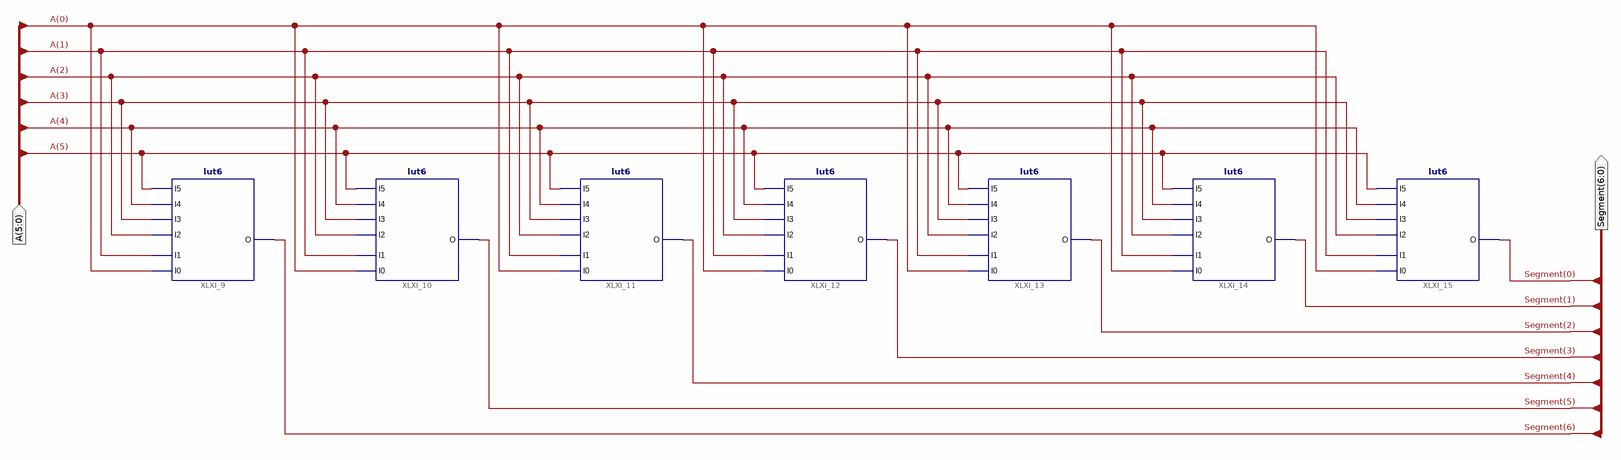
[diagram p0: schematic sheet 1]
// Xilinx ISE schematic ssd1d_0_ztb.sch (spartan6) as structural Verilog: 7 symbols, 2 ports
module ssd1d_0_ztb (
  input  [5:0] A,
  output [6:0] Segment
);

  lut6 #(.INIT("00000038D84EB6F8")) XLXI_9 (
    .O(Segment[6]), .I0(A[0]), .I1(A[1]), .I2(A[2]), .I3(A[3]), .I5(A[5]), .I4(A[4]));
  lut6 #(.INIT("00000015FECF76E2")) XLXI_10 (
    .O(Segment[5]), .I0(A[0]), .I1(A[1]), .I2(A[2]), .I3(A[3]), .I5(A[5]), .I4(A[4]));
  lut6 #(.INIT("00000023AFCBF28A")) XLXI_11 (
    .O(Segment[4]), .I0(A[0]), .I1(A[1]), .I2(A[2]), .I3(A[3]), .I5(A[5]), .I4(A[4]));
  lut6 #(.INIT("00000037C4A5E6DA")) XLXI_12 (
    .O(Segment[3]), .I0(A[0]), .I1(A[1]), .I2(A[2]), .I3(A[3]), .I5(A[5]), .I4(A[4]));
  lut6 #(.INIT("0000001B573CB7F6")) XLXI_13 (
    .O(Segment[2]), .I0(A[0]), .I1(A[1]), .I2(A[2]), .I3(A[3]), .I5(A[5]), .I4(A[4]));
  lut6 #(.INIT("0000003D1E3C973E")) XLXI_14 (
    .O(Segment[1]), .I0(A[0]), .I1(A[1]), .I2(A[2]), .I3(A[3]), .I5(A[5]), .I4(A[4]));
  lut6 #(.INIT("000000207F0757DA")) XLXI_15 (
    .O(Segment[0]), .I0(A[0]), .I1(A[1]), .I2(A[2]), .I3(A[3]), .I5(A[5]), .I4(A[4]));
endmodule
